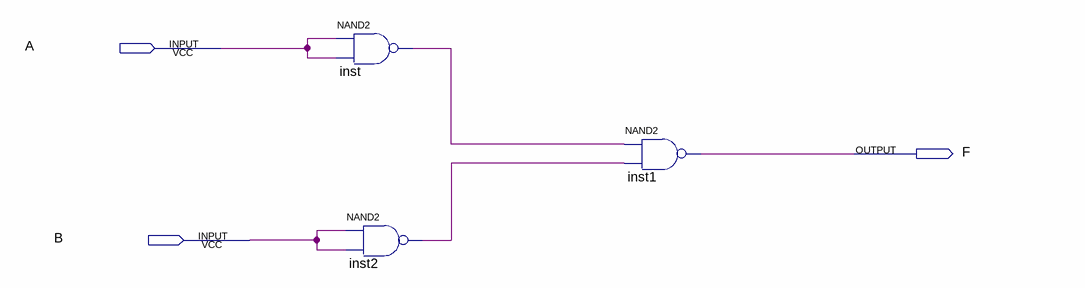
[diagram p0: schematic sheet]
// Quartus schematic fatih2.bdf as structural Verilog: 3 symbols, 3 pins
module fatih2 (
  input  A,
  input  B,
  output F
);

  wire inst2_out, inst_out;

  nand inst (inst_out, A, A);
  nand inst2 (inst2_out, B, B);
  nand inst1 (F, inst_out, inst2_out);
endmodule
